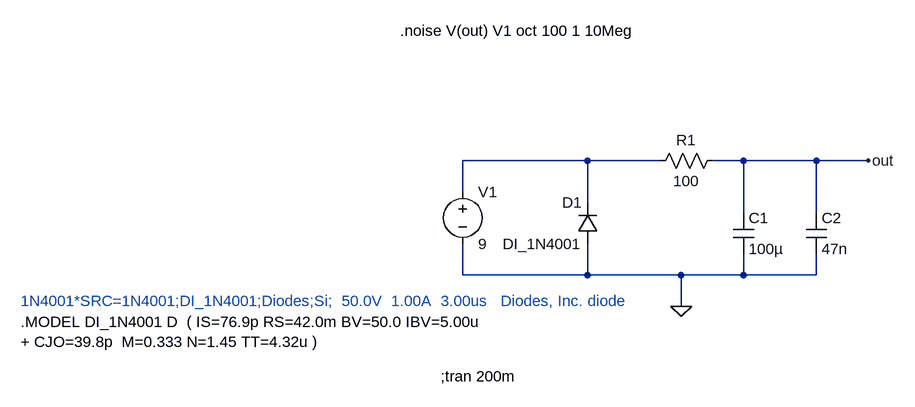
[diagram p0: schematic Basic Power Supply Filter.asc]
Basic Power Supply Filter.asc, the LTspice schematic file:
Version 4
SHEET 1 1080 680
WIRE 160 48 -32 48
WIRE 272 48 160 48
WIRE 400 48 352 48
WIRE 512 48 400 48
WIRE 592 48 512 48
WIRE -32 96 -32 48
WIRE 160 112 160 48
WIRE 400 128 400 48
WIRE 512 128 512 48
WIRE -32 224 -32 176
WIRE 160 224 160 176
WIRE 160 224 -32 224
WIRE 304 224 160 224
WIRE 400 224 400 192
WIRE 400 224 304 224
WIRE 512 224 512 192
WIRE 512 224 400 224
WIRE 304 272 304 224
FLAG 304 272 0
FLAG 592 48 out
SYMBOL voltage -32 80 R0
WINDOW 123 0 0 Left 2
WINDOW 39 0 0 Left 2
SYMATTR InstName V1
SYMATTR Value 9
SYMBOL res 256 64 R270
WINDOW 0 32 56 VTop 2
WINDOW 3 0 56 VBottom 2
SYMATTR InstName R1
SYMATTR Value 100
SYMBOL cap 384 128 R0
SYMATTR InstName C1
SYMATTR Value 100µ
SYMBOL cap 496 128 R0
SYMATTR InstName C2
SYMATTR Value 47n
SYMBOL diode 176 176 R180
WINDOW 0 24 64 Left 2
WINDOW 3 24 0 Left 2
SYMATTR InstName D1
SYMATTR Value DI_1N4001
TEXT -712 296 Left 2 !.MODEL DI_1N4001 D  ( IS=76.9p RS=42.0m BV=50.0 IBV=5.00u\n+ CJO=39.8p  M=0.333 N=1.45 TT=4.32u )
TEXT -66 380 Left 2 !;tran 200m
TEXT -712 264 Left 2 ;1N4001*SRC=1N4001;DI_1N4001;Diodes;Si;  50.0V  1.00A  3.00us   Diodes, Inc. diode
TEXT -128 -152 Left 2 !.noise V(out) V1 oct 100 1 10Meg

The netlist it stands for:
* Basic Power Supply Filter.asc
V1 N001 0 9
R1 N001 out 100
C1 out 0 100µ
C2 out 0 47n
D1 0 N001 DI_1N4001
.model D D
.lib standard.dio
.MODEL DI_1N4001 D  ( IS=76.9p RS=42.0m BV=50.0 IBV=5.00u
+ CJO=39.8p  M=0.333 N=1.45 TT=4.32u )
;tran 200m
* 1N4001*SRC=1N4001;DI_1N4001;Diodes;Si;  50.0V  1.00A  3.00us   Diodes, Inc. diode
.noise V(out) V1 oct 100 1 10Meg
.backanno
.end